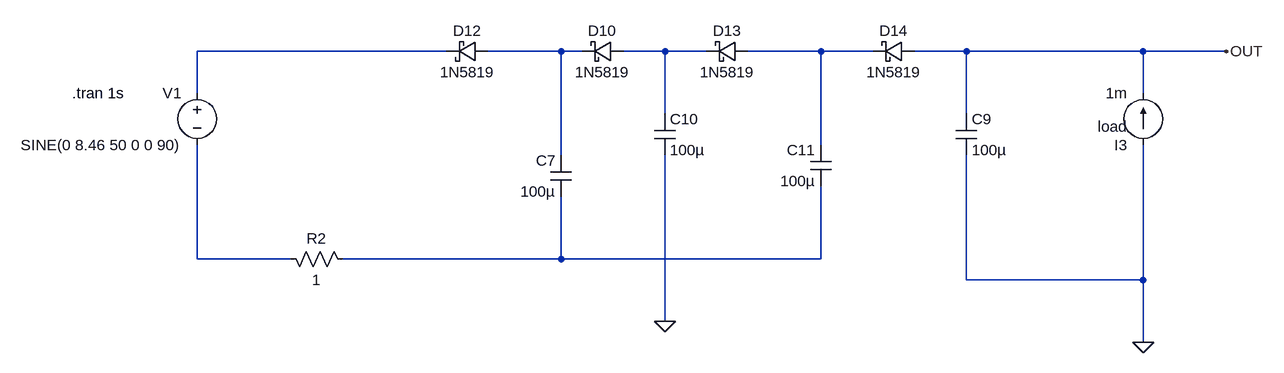
[diagram p0: schematic aux_neg_rail_charge_pump_play_around.asc]
aux_neg_rail_charge_pump_play_around.asc, the LTspice schematic file:
Version 4
SHEET 1 3604 680
WIRE -592 -48 -976 -48
WIRE -416 -48 -528 -48
WIRE -384 -48 -416 -48
WIRE -256 -48 -320 -48
WIRE -192 -48 -256 -48
WIRE -16 -48 -128 -48
WIRE 64 -48 -16 -48
WIRE 208 -48 128 -48
WIRE 480 -48 208 -48
WIRE 608 -48 480 -48
WIRE -976 16 -976 -48
WIRE 480 16 480 -48
WIRE -256 48 -256 -48
WIRE 208 48 208 -48
WIRE -16 96 -16 -48
WIRE -416 112 -416 -48
WIRE -976 272 -976 96
WIRE -832 272 -976 272
WIRE -416 272 -416 176
WIRE -416 272 -752 272
WIRE -16 272 -16 160
WIRE -16 272 -416 272
WIRE 208 304 208 112
WIRE 480 304 480 96
WIRE 480 304 208 304
WIRE -256 368 -256 112
WIRE 480 400 480 304
FLAG 480 400 0
FLAG 608 -48 OUT
FLAG -256 368 0
SYMBOL res -736 288 M270
WINDOW 0 32 56 VTop 2
WINDOW 3 0 56 VBottom 2
SYMATTR InstName R2
SYMATTR Value 1
SYMBOL voltage -976 0 M0
WINDOW 123 0 0 Left 2
WINDOW 39 0 0 Left 2
SYMATTR InstName V1
SYMATTR Value SINE(0 8.46 50 0 0 90)
SYMBOL cap -400 112 M0
SYMATTR InstName C7
SYMATTR Value 100µ
SYMBOL schottky -320 -32 M270
WINDOW 0 32 32 VTop 2
WINDOW 3 0 32 VBottom 2
SYMATTR InstName D10
SYMATTR Value 1N5819
SYMATTR Description Diode
SYMATTR Type diode
SYMBOL cap 192 48 R0
SYMATTR InstName C9
SYMATTR Value 100µ
SYMBOL current 480 96 R180
WINDOW 123 0 0 Left 0
WINDOW 39 24 28 Left 2
SYMATTR SpiceLine load
SYMATTR InstName I3
SYMATTR Value 1m
SYMBOL schottky -528 -64 R90
WINDOW 0 0 32 VBottom 2
WINDOW 3 32 32 VTop 2
SYMATTR InstName D12
SYMATTR Value 1N5819
SYMATTR Description Diode
SYMATTR Type diode
SYMBOL schottky -128 -32 M270
WINDOW 0 32 32 VTop 2
WINDOW 3 0 32 VBottom 2
SYMATTR InstName D13
SYMATTR Value 1N5819
SYMATTR Description Diode
SYMATTR Type diode
SYMBOL schottky 128 -32 M270
WINDOW 0 32 32 VTop 2
WINDOW 3 0 32 VBottom 2
SYMATTR InstName D14
SYMATTR Value 1N5819
SYMATTR Description Diode
SYMATTR Type diode
SYMBOL cap -272 48 R0
SYMATTR InstName C10
SYMATTR Value 100µ
SYMBOL cap 0 96 M0
SYMATTR InstName C11
SYMATTR Value 100µ
TEXT -1168 16 Left 2 !.tran 1s

The netlist it stands for:
* aux_neg_rail_charge_pump_play_around.asc
R2 N006 N005 1
V1 N001 N005 SINE(0 8.46 50 0 0 90)
C7 N002 N006 100µ
D10 N003 N002 1N5819
C9 OUT 0 100µ
I3 0 OUT 1m load
D12 N002 N001 1N5819
D13 N004 N003 1N5819
D14 OUT N004 1N5819
C10 N003 0 100µ
C11 N004 N006 100µ
.model D D
.lib standard.dio
.tran 1s
.backanno
.end